# Altium schematic sheet DirCtl.SchDoc
size Letter; SheetNumber: 3; SheetTotal: 8
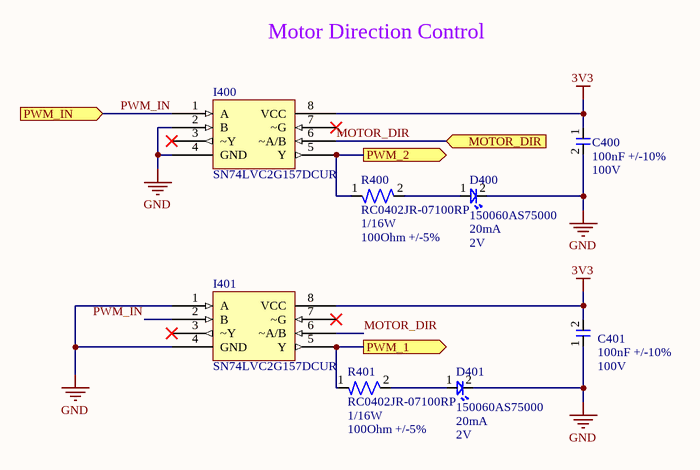
[diagram p0: DirCtl.SchDoc]

## Parts
C400  Capacitance: 100nF +/-10%  Voltage Rating: 100V  [CAP-0603]  (hidden comment: CC0603KRX7R0BB104)
C401  Capacitance: 100nF +/-10%  Voltage Rating: 100V  [CAP-0603]  (hidden comment: CC0603KRX7R0BB104)
D400  150060AS75000  Current Rating: 20mA  Vf: 2V  [LED-0603]
D401  150060AS75000  Current Rating: 20mA  Vf: 2V  [LED-0603]
I400  SN74LVC2G157DCUR  [IC-MUX-8VSSOP]
I401  SN74LVC2G157DCUR  [IC-MUX-8VSSOP]
R400  RC0402JR-07100RP  Power Rating: 1/16W  Resistance: 100Ohm +/-5%  [RES-0402]
R401  RC0402JR-07100RP  Power Rating: 1/16W  Resistance: 100Ohm +/-5%  [RES-0402]

## Ports
MOTOR_DIR (in), PWM_1 (out), PWM_2 (out), PWM_IN (in)

## Nets
3V3: C400.1 C401.2 I400.8(VCC) I401.8(VCC)
GND: C400.2 C401.1 D400.2 D401.2 I400.2(B) I400.4(GND) I401.1(A) I401.4(GND)
`: I400.6(~A/B) I401.6(~A/B) ; port MOTOR_DIR  [also labelled MOTOR_DIR]
PWM_1: I401.5(Y) R401.1 ; port PWM_1
PWM_2: I400.5(Y) R400.1 ; port PWM_2
PWM_IN: I400.1(A) I401.2(B) ; port PWM_IN
NetD400_1: D400.1 R400.2
NetD401_1: D401.1 R401.2

Not connected (* = marked no-connect by the designer): I400 3(~Y)* 7(~G)*; I401 3(~Y)* 7(~G)*

## Notes on the sheet
- Motor Direction Control

## Library data of the parts
C400 C401 = CAP-100N-0001: CAP CER 0.1UF 100V X7R 0603; Manufacturer: YAGEO; Assembled?: no; Manufacturer Part Number: CC0603KRX7R0BB104; Temperature Coefficient: X7R; Package Size: 0603
D400 D401 = LED_Amber_0001: CAP CER 0.1UF 100V X7R 0603; Manufacturer: Wurth Electronik; Assembled?: no; Color: Amber; Manufacturer Part Number: 150060AS75000; Package Size: 0603
I400 = IC-MUX-0001
I401 = IC-MUX-0001: Multiplexer 1 x 2:1 8-VSSOP; Vin: 1.65-5.5V
R400 R401 = RES-100-0001: RES SMD 100 OHM 5% 1/16W 0402; Manufacturer: YAGEO; Assembled?: no; Manufacturer Part Number: RC0402JR-07100RP; Package Size: 0402